# EAGLE design base-6u-at91sam7s-eval-r3 (EAGLE 5.09)
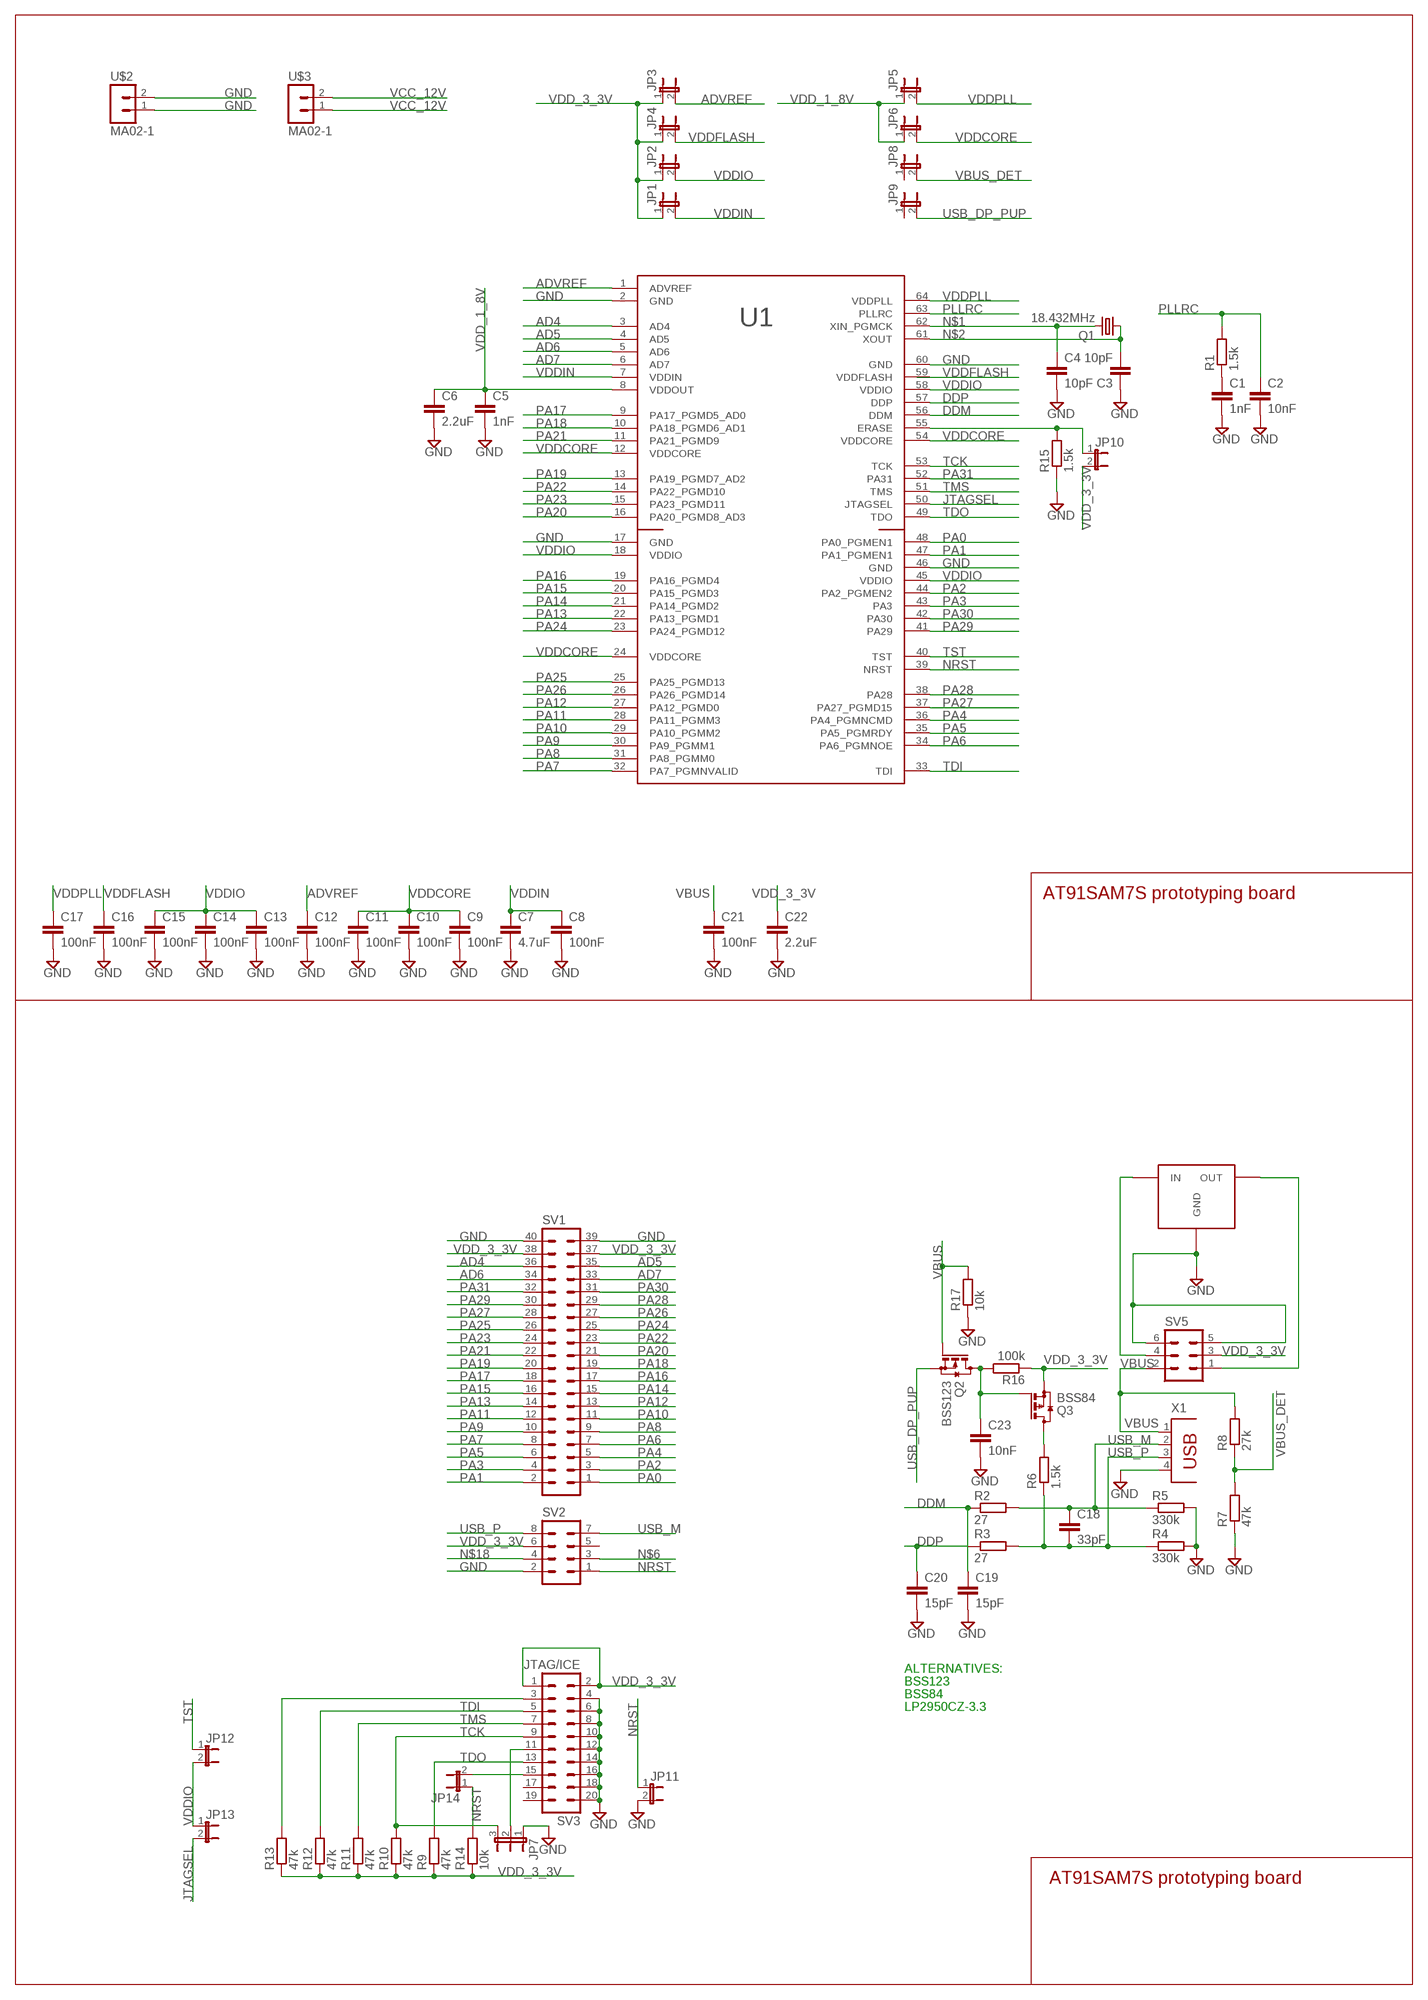
[diagram p0: schematic, sheet 1]

## Parts
C1  1nF  C-EUC0603  [C0603]
C2  10nF  C-EUC0603  [C0603]
C3  10pF  C-EUC0603  [C0603]
C4  10pF  C-EUC0603  [C0603]
C5  1nF  C-EUC0603  [C0603]
C6  2.2uF  C-EUC1206  [C1206]
C7  4.7uF  C-EUC1206  [C1206]
C8  100nF  C-EUC0603  [C0603]
C9  100nF  C-EUC0603  [C0603]
C10  100nF  C-EUC0603  [C0603]
C11  100nF  C-EUC0603  [C0603]
C12  100nF  C-EUC0603  [C0603]
C13  100nF  C-EUC0603  [C0603]
C14  100nF  C-EUC0603  [C0603]
C15  100nF  C-EUC0603  [C0603]
C16  100nF  C-EUC0603  [C0603]
C17  100nF  C-EUC0603  [C0603]
C18  33pF  C-EUC0603  [C0603]
C19  15pF  C-EUC0603  [C0603]
C20  15pF  C-EUC0603  [C0603]
C21  100nF  C-EUC0603  [C0603]
C22  2.2uF  C-EUC1206  [C1206]
C23  10nF  C-EUC0603  [C0603]
JP1  JP1E  [JP1]
JP2  JP1E  [JP1]
JP3  JP1E  [JP1]
JP4  JP1E  [JP1]
JP5  JP1E  [JP1]
JP6  JP1E  [JP1]
JP7  JP2E  [JP2]
JP8  JP1E  [JP1]
JP9  JP1E  [JP1]
JP10  JP1E  [JP1]
JP11  JP1E  [JP1]
JP12  JP1E  [JP1]
JP13  JP1E  [JP1]
JP14  JP1E  [JP1]
Q1  18.432MHz  CRYSTALHC49S  [HC49/S]
Q2  BSS123  [SOT23]
Q3  BSS84  [SOT23]
R1  1.5k  R-0603  [R0603]
R2  27  R-EU_R0603  [R0603]
R3  27  R-EU_R0603  [R0603]
R4  330k  R-EU_R0603  [R0603]
R5  330k  R-EU_R0603  [R0603]
R6  1.5k  R-EU_R0603  [R0603]
R7  47k  R-EU_R0603  [R0603]
R8  27k  R-EU_R0603  [R0603]
R9  47k  R-0603  [R0603]
R10  47k  R-0603  [R0603]
R11  47k  R-0603  [R0603]
R12  47k  R-0603  [R0603]
R13  47k  R-0603  [R0603]
R14  10k  R-0603  [R0603]
R15  1.5k  R-0603  [R0603]
R16  100k  R-EU_R0603  [R0603]
R17  10k  R-EU_R0603  [R0603]
SV1  MA20-2  [MA20-2]
SV2  MA04-2  [MA04-2]
SV3  JTAG/ICE  MA10-2W  [MA10-2W]
SV5  MA03-2  [MA03-2]
U1  AT91SAM7S64_LQFP64  [LQFP64]
U$1  LF33CDT  [TO-252]
U$2  MA02-1  [MA02-1]
U$3  MA02-1  [MA02-1]
X1  PN61729  [PN61729]

## Nets
AD4: SV1.36 U1.3(AD4)
AD5: SV1.35 U1.4(AD5)
AD6: SV1.34 U1.5(AD6)
AD7: SV1.33 U1.6(AD7)
ADVREF: C12.1 JP3.2 U1.1(ADVREF)
DDM: C19.1 R2.1 U1.56(DDM)
DDP: C20.1 R3.1 U1.57(DDP)
GND: C1.2 C2.2 C3.1 C4.2 C5.2 C6.2 C7.2 C8.2 C9.2 C10.2 C11.2 C12.2 C13.2 C14.2 C15.2 C16.2 C17.2 C19.2 C20.2 C21.2 C22.2 C23.2 JP7.1 JP11.2 R4.2 R5.2 R7.1 R15.1 R17.1 SV1.39 SV1.40 SV2.2 SV3.4 SV3.6 SV3.8 SV3.10 SV3.12 SV3.14 SV3.16 SV3.18 SV3.20 SV5.5 SV5.6 U1.2(GND) U1.17(GND) U1.46(GND) U1.60(GND) U$1.3(GND) U$2.1 U$2.2 X1.4
JTAGSEL: JP13.2 U1.50(JTAGSEL)
N$1: C4.1 Q1.2 U1.62(XIN_PGMCK)
N$2: C3.2 Q1.1 U1.61(XOUT)
N$3: C1.1 R1.1
N$6: SV2.3
N$7: Q3.3(D) R6.2
N$9: JP14.2 SV3.15
N$11: SV5.4 U$1.1(IN)
N$12: SV5.1 U$1.2(OUT)
N$13: R13.2 SV3.3
N$15: JP10.1 R15.2 U1.55(ERASE)
N$16: JP7.2 SV3.11
N$17: C23.1 Q2.3(D) Q3.1(G) R16.2
N$18: SV2.4
NRST: JP11.1 JP14.1 R14.2 SV2.1 U1.39(NRST)
PA0: SV1.1 U1.48(PA0_PGMEN1)
PA1: SV1.2 U1.47(PA1_PGMEN1)
PA2: SV1.3 U1.44(PA2_PGMEN2)
PA3: SV1.4 U1.43(PA3)
PA4: SV1.5 U1.36(PA4_PGMNCMD)
PA5: SV1.6 U1.35(PA5_PGMRDY)
PA6: SV1.7 U1.34(PA6_PGMNOE)
PA7: SV1.8 U1.32(PA7_PGMNVALID)
PA8: SV1.9 U1.31(PA8_PGMM0)
PA9: SV1.10 U1.30(PA9_PGMM1)
PA10: SV1.11 U1.29(PA10_PGMM2)
PA11: SV1.12 U1.28(PA11_PGMM3)
PA12: SV1.13 U1.27(PA12_PGMD0)
PA13: SV1.14 U1.22(PA13_PGMD1)
PA14: SV1.15 U1.21(PA14_PGMD2)
PA15: SV1.16 U1.20(PA15_PGMD3)
PA16: SV1.17 U1.19(PA16_PGMD4)
PA17: SV1.18 U1.9(PA17_PGMD5_AD0)
PA18: SV1.19 U1.10(PA18_PGMD6_AD1)
PA19: SV1.20 U1.13(PA19_PGMD7_AD2)
PA20: SV1.21 U1.16(PA20_PGMD8_AD3)
PA21: SV1.22 U1.11(PA21_PGMD9)
PA22: SV1.23 U1.14(PA22_PGMD10)
PA23: SV1.24 U1.15(PA23_PGMD11)
PA24: SV1.25 U1.23(PA24_PGMD12)
PA25: SV1.26 U1.25(PA25_PGMD13)
PA26: SV1.27 U1.26(PA26_PGMD14)
PA27: SV1.28 U1.37(PA27_PGMD15)
PA28: SV1.29 U1.38(PA28)
PA29: SV1.30 U1.41(PA29)
PA30: SV1.31 U1.42(PA30)
PA31: SV1.32 U1.52(PA31)
PLLRC: C2.1 R1.2 U1.63(PLLRC)
TCK: JP7.3 R10.2 SV3.9 U1.53(TCK)
TDI: R12.2 SV3.5 U1.33(TDI)
TDO: R9.2 SV3.13 U1.49(TDO)
TMS: R11.2 SV3.7 U1.51(TMS)
TST: JP12.1 U1.40(TST)
USB_DP_PUP: JP9.2 Q2.2(S)
USB_M: C18.1 R2.2 R5.1 SV2.7 X1.2
USB_P: C18.2 R3.2 R4.1 R6.1 SV2.8 X1.3
VBUS: C21.1 Q2.1(G) R8.2 R17.2 SV5.2 X1.1
VBUS_DET: JP8.2 R7.2 R8.1
VCC_12V: U$3.1 U$3.2
VDD_1_8V: C5.1 C6.1 JP5.1 JP6.1 U1.8(VDDOUT)
VDD_3_3V: C22.1 JP1.1 JP2.1 JP3.1 JP4.1 JP10.2 Q3.2(S) R9.1 R10.1 R11.1 R12.1 R13.1 R14.1 R16.1 SV1.37 SV1.38 SV2.6 SV3.1 SV3.2 SV5.3
VDDCORE: C9.1 C10.1 C11.1 JP6.2 U1.12(VDDCORE) U1.24(VDDCORE) U1.54(VDDCORE)
VDDFLASH: C16.1 JP4.2 U1.59(VDDFLASH)
VDDIN: C7.1 C8.1 JP1.2 U1.7(VDDIN)
VDDIO: C13.1 C14.1 C15.1 JP2.2 JP12.2 JP13.1 U1.18(VDDIO) U1.45(VDDIO) U1.58(VDDIO)
VDDPLL: C17.1 JP5.2 U1.64(VDDPLL)
Unconnected: JP8.1 JP9.1 SV2.5 SV3.17 SV3.19

## Notes on the sheet
- AT91SAM7S prototyping board
- ALTERNATIVES:
- BSS123
- BSS84
- LP2950CZ-3.3
- AT91SAM7S prototyping board

## Library data of the parts
C1-C23 = rcl:C-EU: CAPACITOR, European symbol
JP1-JP6 JP8-JP14 = jumper:JP1E: JUMPER
JP7 = jumper:JP2E: JUMPER
Q1 = crystal:CRYSTAL: CRYSTAL
Q2 = transistor-small-signal:BSS123: N-CHANNEL MOS FET
Q3 = transistor-small-signal:BSS84: P-CHANNEL MOS FET
R1 R9-R15 = quantum-sensor:R: Resistor
R2-R8 R16 R17 = rcl:R-EU_: RESISTOR, European symbol
SV1 = con-lstb:MA20-2: PIN HEADER
SV2 = con-lstb:MA04-2: PIN HEADER
SV3 = con-lstb:MA10-2W: PIN HEADER
SV5 = con-lstb:MA03-2: PIN HEADER
U1 = Atmel_Prototype_Header:AT91SAM7S64: Atmel AT91 ARM Thumb-based Microcontroller. LQFP64 package.
U$1 = my-to252:LF33CDT
U$2 U$3 = cls:MA02-1
X1 = con-berg:PN61729: BERG USB connector

## Board
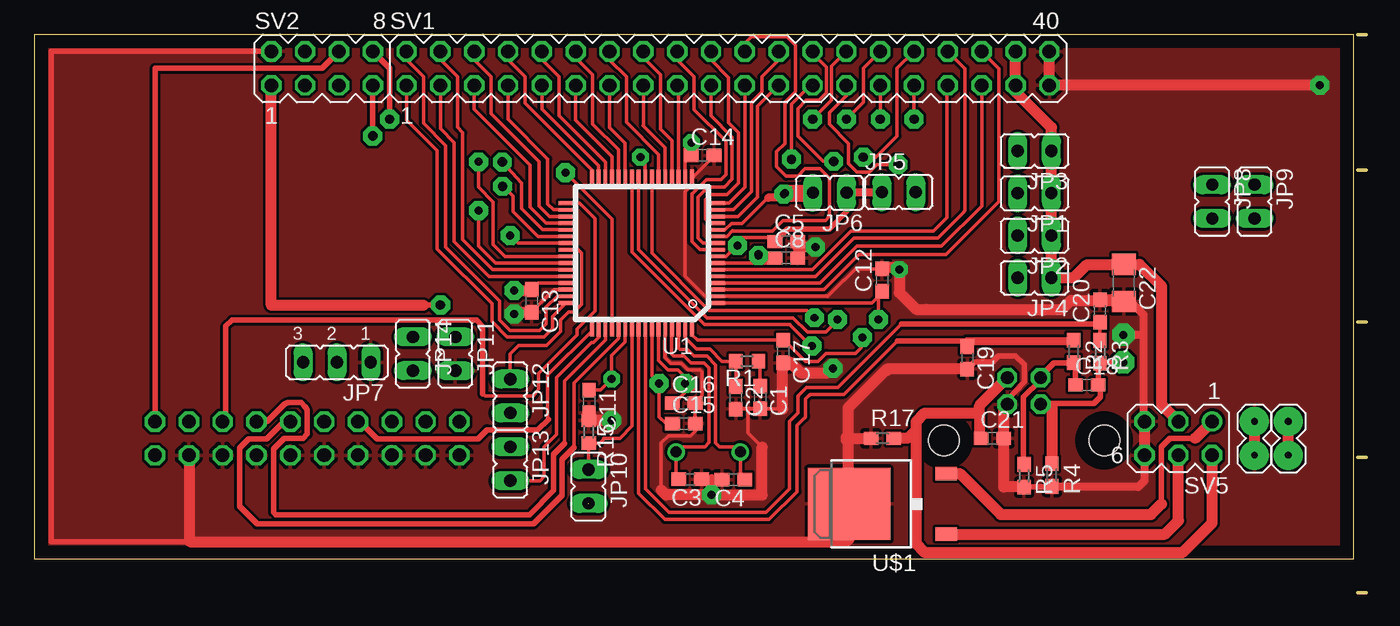
[diagram p1: board, top side]
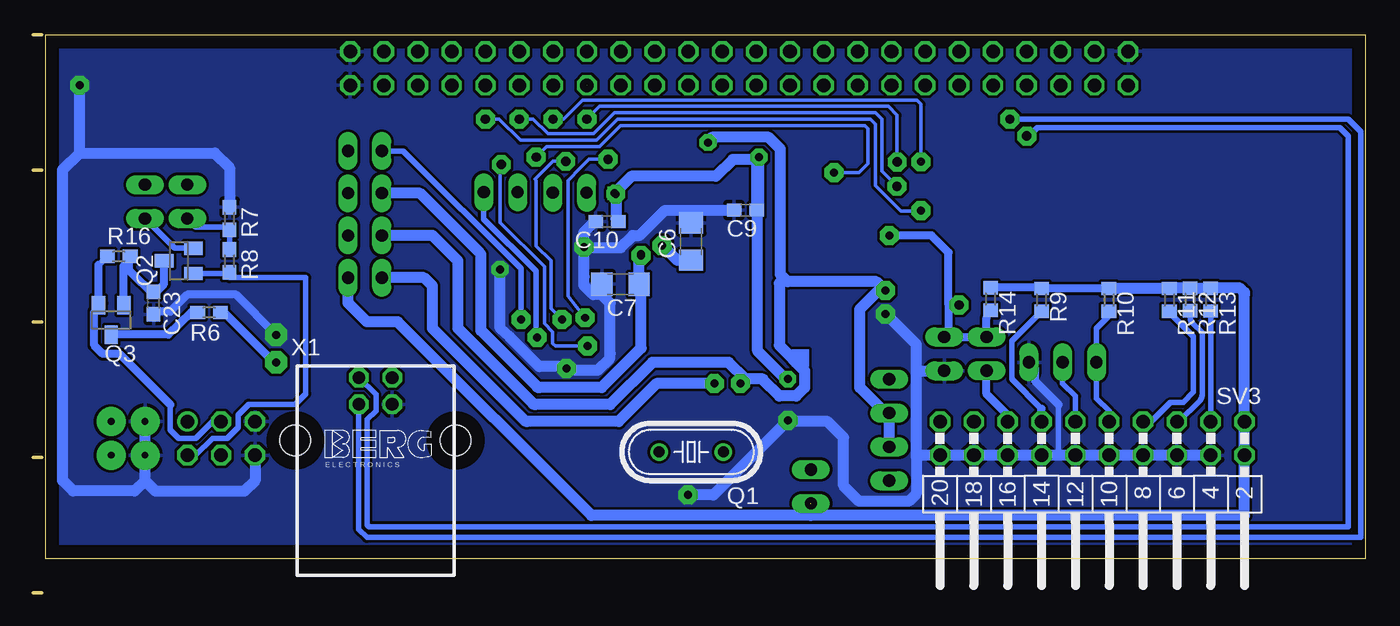
[diagram p2: board, bottom side, seen from below]

Size 99.99 x 41.92 mm. Coordinates in mm from the lower left corner, seen from the top.
Outline: 99.36,41.91 100,41.91
Outline: 99.36,31.75 100,31.75
Outline: 99.36,20.32 100,20.32
Outline: 99.36,10.16 100,10.16
Outline: 99.36,0 100,0
Outline: 0.01,2.54 99.07,2.54 99.07,41.92 0,41.92 0.01,2.54
Copper layers (1*16): Top 0.035mm / dielectric 1.5mm / Bottom 0.035mm
Design rules "default": minimum track width 10mil, minimum drill 24mil, track to track 8mil, track to pad 8mil, pad to pad 8mil, via to via 8mil, smd to smd 8mil, copper to edge 40mil, drill to drill 8mil, minimum pad ring 10mil, minimum via ring 8mil, stop-mask expansion 4mil, vias tented up to drill 0mil, thermal gap 10mil

### Footprints (pad centres in the part's own frame; a part is rotated, then mirrored left to right if it is on the bottom)
C0603 = smd 1.1 x 1: 1 -0.85,0; 2 0.85,0
C1206 = smd 1.6 x 1.8: 1 -1.4,0; 2 1.4,0
JP1 = drill 0.914 long: 1 0,-1.27; 2 0,1.27
JP2 = drill 0.914 long: 1 -2.54,0; 2 0,0; 3 2.54,0
HC49/S = drill 0.813 round: 1 -2.413,0; 2 2.413,0
SOT23 = smd 1 x 1.4: 1 -0.95,-1.1; 2 0.95,-1.1; 3 0,1.1
R0603 = smd 1 x 1.1: 1 -0.85,0; 2 0.85,0
R0603' = smd 1.1 x 1: 1 -0.85,0; 2 0.85,0
MA20-2 = drill 1.016 octagon: 1 -24.13,-1.27; 2 -24.13,1.27; 3 -21.59,-1.27; 4 -21.59,1.27; 5 -19.05,-1.27; 6 -19.05,1.27; 7 -16.51,-1.27; 8 -16.51,1.27; 9 -13.97,-1.27; 10 -13.97,1.27; 11 -11.43,-1.27; 12 -11.43,1.27; 13 -8.89,-1.27; 14 -8.89,1.27; 15 -6.35,-1.27; 16 -6.35,1.27; 17 -3.81,-1.27; 18 -3.81,1.27; 19 -1.27,-1.27; 20 -1.27,1.27; 21 1.27,-1.27; 22 1.27,1.27; 23 3.81,-1.27; 24 3.81,1.27; 25 6.35,-1.27; 26 6.35,1.27; 27 8.89,-1.27; 28 8.89,1.27; 29 11.43,-1.27; 30 11.43,1.27; 31 13.97,-1.27; 32 13.97,1.27; 33 16.51,-1.27; 34 16.51,1.27; 35 19.05,-1.27; 36 19.05,1.27; 37 21.59,-1.27; 38 21.59,1.27; 39 24.13,-1.27; 40 24.13,1.27
MA04-2 = drill 1.016 octagon: 1 -3.81,-1.27; 2 -3.81,1.27; 3 -1.27,-1.27; 4 -1.27,1.27; 5 1.27,-1.27; 6 1.27,1.27; 7 3.81,-1.27; 8 3.81,1.27
MA10-2W = drill 1.016 octagon: 1 -11.43,-1.27; 2 -11.43,1.27; 3 -8.89,-1.27; 4 -8.89,1.27; 5 -6.35,-1.27; 6 -6.35,1.27; 7 -3.81,-1.27; 8 -3.81,1.27; 9 -1.27,-1.27; 10 -1.27,1.27; 11 1.27,-1.27; 12 1.27,1.27; 13 3.81,-1.27; 14 3.81,1.27; 15 6.35,-1.27; 16 6.35,1.27; 17 8.89,-1.27; 18 8.89,1.27; 19 11.43,-1.27; 20 11.43,1.27
MA03-2 = drill 1.016 round: 1 -2.54,-1.27 | drill 1.016 octagon: 2 -2.54,1.27; 3 0,-1.27; 4 0,1.27; 5 2.54,-1.27; 6 2.54,1.27
LQFP64 = smd 1.1 x 0.285: 1 -5.7,3.75; 2 -5.7,3.25; 3 -5.7,2.75; 4 -5.7,2.25; 5 -5.7,1.75; 6 -5.7,1.25; 7 -5.7,0.75; 8 -5.7,0.25; 9 -5.7,-0.25; 10 -5.7,-0.75; 11 -5.7,-1.25; 12 -5.7,-1.75; 13 -5.7,-2.25; 14 -5.7,-2.75; 15 -5.7,-3.25; 16 -5.7,-3.75; 33 5.7,-3.75; 34 5.7,-3.25; 35 5.7,-2.75; 36 5.7,-2.25; 37 5.7,-1.75; 38 5.7,-1.25; 39 5.7,-0.75; 40 5.7,-0.25; 41 5.7,0.25; 42 5.7,0.75; 43 5.7,1.25; 44 5.7,1.75; 45 5.7,2.25; 46 5.7,2.75; 47 5.7,3.25; 48 5.7,3.75 | smd 0.285 x 1.1: 17 -3.75,-5.7; 18 -3.25,-5.7; 19 -2.75,-5.7; 20 -2.25,-5.7; 21 -1.75,-5.7; 22 -1.25,-5.7; 23 -0.75,-5.7; 24 -0.25,-5.7; 25 0.25,-5.7; 26 0.75,-5.7; 27 1.25,-5.7; 28 1.75,-5.7; 29 2.25,-5.7; 30 2.75,-5.7; 31 3.25,-5.7; 32 3.75,-5.7; 49 3.75,5.7; 50 3.25,5.7; 51 2.75,5.7; 52 2.25,5.7; 53 1.75,5.7; 54 1.25,5.7; 55 0.75,5.7; 56 0.25,5.7; 57 -0.25,5.7; 58 -0.75,5.7; 59 -1.25,5.7; 60 -1.75,5.7; 61 -2.25,5.7; 62 -2.75,5.7; 63 -3.25,5.7; 64 -3.75,5.7
TO-252 = smd 1 x 1.6: 1 -2.28,-6.07; 2 2.28,-6.07 | smd 5.4 x 6.2: 3 0,1.23
MA02-1 = drill 0.5 pad 2.184 round: 1 -1.27,0; 2 1.27,0
PN61729 = drill 0.95 octagon: 1 1.25,4.71; 2 -1.25,4.71; 3 -1.25,2.71; 4 1.25,2.71 | hole 2.3: -6.02,0; 6.02,0

### Placement (x,y rotation side)
C1  54.49,14.67 270 top
C2  52.66,14.63 270 top
C3  49.23,8.52 180 top
C4  52.47,8.49 180 top
C5  56.45,26.36 0 top
C6  50.6,26.38 90 bottom
C7  55.91,23.16 180 bottom
C8  56.45,25.14 0 top
C9  46.52,28.73 180 bottom
C10  56.92,27.87 180 bottom
C11  41.65,14.36 270 top
C12  63.65,23.47 90 top
C13  37.34,21.91 270 top
C14  50.18,32.83 0 top
C15  48.76,12.69 0 top
C16  48.75,14.22 0 top
C17  56.22,18.12 270 top
C18  79.02,15.59 0 top
C19  70.04,17.64 270 top
C20  80.01,21.16 90 top
C21  71.92,11.59 0 top
C22  81.81,23.26 270 top
C23  90.97,21.75 270 bottom
JP1  75.1,30 90 top
JP2  75.1,26.82 90 top
JP3  75.1,33.17 90 top
JP4  75.1,23.65 90 top
JP5  64.9,30.07 270 top
JP6  59.72,30.04 90 top
JP7  22.71,17.3 180 top
JP8  88.43,29.37 180 top
JP9  91.61,29.37 180 top
JP10  41.61,7.97 180 top
JP11  31.6,17.93 180 top
JP12  35.73,14.76 180 top
JP13  35.73,9.68 180 top
JP14  28.42,17.94 180 top
Q1  50.59,10.57 180 bottom
Q2  89.07,24.92 90 bottom
Q3  94.15,20.48 180 bottom
R1  53.52,17.38 180 top
R2  27  [R0603']  78.03,18.11 270 top
R3  27  [R0603']  80,18.09 270 top
R4  330k  [R0603']  76.39,8.83 270 top
R5  330k  [R0603']  74.31,8.78 270 top
R6  1.5k  [R0603']  86.8,21.05 180 bottom
R7  47k  [R0603']  85.26,28.09 270 bottom
R8  27k  [R0603']  85.26,24.92 270 bottom
R9  24.29,21.99 270 bottom
R10  19.24,21.98 270 bottom
R11  14.69,21.99 270 bottom
R12  13.13,22.02 270 bottom
R13  11.59,22 270 bottom
R14  28.12,22.05 270 bottom
R15  41.62,12.09 270 top
R16  100k  [R0603']  93.57,25.25 0 bottom
R17  10k  [R0603']  63.67,11.59 0 top
SV1  52.07,39.38 0 top
SV2  21.6,39.38 0 top
SV3  20.48,11.58 180 bottom
SV5  85.89,11.59 180 top
U1  45.61,25.5 180 top
U$1  62.4,6.66 90 top
U$2  91.61,11.59 90 top
U$3  94.15,11.59 90 top
X1  74.3,11.44 0 bottom

### Tracks (layer width: path | path; a pad name or v marks a point on that pad's centre or on a via)
AD4
  Top 0.254: U1.3 59.28,22.75 61.92,25.4 68.43,25.4 72.4,29.36 72.4,39.37 SV1.36
AD5
  Top 0.254: U1.4 58.99,23.25 61.76,26.03 68.11,26.03 71.13,29.05 SV1.35
AD6
  Top 0.254: U1.5 58.64,23.75 61.52,26.64 67.84,26.64 69.78,28.58 arc-45 69.79,28.6 69.87,28.68 69.87,39.36 SV1.34
AD7
  Top 0.254: U1.6 58.41,24.25 61.29,27.14 67.49,27.14 68.51,28.16 | 68.51,28.16 68.51,28.15 | 68.51,28.16 68.51,38.04 SV1.33
ADVREF  (via drill 0.6 pad 1.42)
  Top 0.254: v63.38,20.51 63.38,22.25 63.67,22.54 | 63.67,22.54 63.65,22.55 C12.1 | U1.1 62.88,21.75 63.67,22.54
  Bottom 0.406: v63.38,20.51 63.38,24.33 72.23,33.17 JP3.2
DDM
  Top 0.254: U1.56 45.36,7.46 47.34,5.48 55.17,5.48 57.26,7.58 57.26,12.54 57.83,13.11 arc45 57.9,13.29 57.9,14.54 58.17,14.81 arc-45 58.35,14.88 60.79,14.88 64.8,18.89 | 70.02,18.89 70.02,18.51 C19.1 | 77.97,18.89 R2.1
  Top 0.406: 64.8,18.89 70.02,18.89
  Top 0.61: 70.02,18.89 77.97,18.89
DDP
  Top 0.254: 45.88,19.77 45.88,7.78 47.63,6.03 54.94,6.03 56.68,7.77 56.68,12.75 arc-45 56.76,12.93 57.32,13.49 57.32,14.65 arc-45 57.39,14.83 57.95,15.39 60.33,15.39 65.1,20.16 | C20.1 80.05,20.3 79.96,20.21 | R3.1 80.02,18.93 80.01,18.95 C20.1 | 80.18,20.16 C20.1
  Top 0.305: U1.57 45.86,19.79 45.88,19.77
  Top 0.406: 65.1,20.16 80.18,20.16
GND  (via drill 0.6 pad 1.27, 0.6 pad 1.42, 0.6 pad 1.68)
  Top 0.254: 52.88,13.78 52.85,13.81 | 53.54,13.78 53.56,13.76 53.56,12 54.64,10.93 | C2.2 52.66,13.77 52.66,13.76 52.71,13.81 C1.2 | C1.2 54.51,13.81 54.52,13.8 54.5,13.78 53.54,13.78 | 53.54,13.78 52.88,13.78 | 53.54,13.78 53.5,13.78 53.48,13.8 53.46,13.78 52.88,13.78 | C17.2 56.18,17.23 56.18,13.79 56.17,13.8 54.48,13.8 | 54.48,13.8 54.47,13.8 | C1.2 54.48,13.8 | 51.29,22.25 51.26,22.25 51.24,22.23 51.21,22.26 50.35,22.26 48.85,23.76 48.85,30.12 49.36,30.63 U1.17 49.43,31.2 51.05,32.82 51.05,32.83 C14.2 | C13.2 39.03,22.75 U1.46 | 57.3,26.68 C5.2 57.3,25.94 C8.2 | 50.84,7.69 51.62,8.47 C4.2 50.86,8.48 50.1,8.48 50.09,8.47 50.08,8.48 C3.1 | 47.06,7.7 47.06,11.23 47.6,11.77 49.25,11.77 49.7,12.22 49.61,12.31 C15.2 49.61,12.72 49.59,12.73 49.6,12.74 C16.2 49.6,14.26 49.59,14.26 50.13,14.8 50.13,16.57 49.98,16.72 49.07,16.72 48.57,17.22 47.81,17.22 47.36,17.67 U1.60 | 82.08,21.94 82.08,21.74 82.04,21.79 arc45 81.86,21.86 C22.2 | C11.2 41.62,13.48 R15.1 | 51.29,22.25 U1.2 | 59.55,22.26 51.3,22.26 51.29,22.25 | 59.55,22.26 59.58,22.26 | 59.55,22.26 59.55,22.24 60.8,23.49 60.81,23.49 61.64,24.32 C12.2 63.65,24.43 | 63.65,24.43 63.67,24.44 | 63.57,24.42 63.64,24.42 63.65,24.43 | v64.94,24.28 64.94,24.42
  Top 0.406: SV3.18 | SV3.16 | SV3.14 | SV3.10 | SV3.12 | SV3.6 | SV3.8 | SV3.20 | 70.05,16.84 70.05,16.8 C19.2 70.56,17.31 71.92,17.31 72.4,17.79 73.67,17.79 74.32,17.13 74.32,15.8 73.03,14.45 | R5.2 76.28,7.92 76.39,7.92 R4.2 | 72.77,13.94 73.02,14.19 | SV3.4 | SV2.2 1.28,40.65 1.28,3.82 11.67,3.82
  Top 0.61: C17.2 56.25,17.3 | R4.2 76.25,7.97 76.24,7.96 76.28,7.92 82.87,7.92 83.35,8.41 SV5.6 | C22.2 81.83,21.86 | 82.08,21.74 82.41,21.74 83.28,20.88 83.28,19.53 | 83.28,19.53 83.28,12.93 SV5.5 | v81.77,19.36 83.11,19.36 83.28,19.53
  Top 0.813: v58.65,25.94 57.3,25.94 | 82.08,21.94 C20.2 | 82.08,21.94 77.84,21.94 77.16,21.27 66.97,21.27 66.21,21.27 64.94,22.54 v64.94,24.28 | 64.94,24.42 63.57,24.42 | 56.18,13.79 56.18,16.8 56.68,17.3 56.75,17.3 57.54,16.5 59.53,16.5 v59.97,16.84 | v43.33,12.93 R15.1 | 50.86,8.48 50.86,8.47 50.83,8.44 v50.83,7.33 | C13.2 36.08,21.06 v36.01,20.92 | 58.51,6.43 arc45 58.59,6.61 61.17,6.61 U$1.3 | 70.02,16.66 70.02,16.73 arc-45 C19.2 | 63.8,16.59 61.09,13.88 61.09,11.58 R17.1 | 63.8,16.59 arc-45 63.98,16.66 | C19.2 | C19.2 | 63.8,16.59 64,16.79 C19.2 | R5.2 72.77,7.92 C21.2 72.77,13.94 | SV5.5 SV5.6 | 82.08,21.94 82.08,21.74 | U$2.2 U$2.1 | SV1.40 SV1.39 v96.53,38.11 | SV3.4 11.67,10.24 11.67,3.82 60.97,3.82 61.17,4.02 U$1.3 | v96.53,38.11 | 73.02,14.19 73.02,14.18 X1.4 73.03,14.17 73.03,14.45 | v50.83,7.33 54.64,7.33 54.64,10.93 | 47.06,7.7 47.44,7.33 v50.83,7.33 | U$1.3 61.12,6.66 61.12,11.68 60.97,11.68 60.97,11.44
  Bottom 0.254: 36.36,21.11 36.18,20.92 v36.01,20.92 | SV3.6 | SV3.8 | SV3.10 | SV3.12 | SV3.16 | SV3.18 | SV3.20
  Bottom 0.406: v43.34,12.93 43.38,12.89 | v43.33,12.93 v43.34,12.93 | v43.34,12.93 43.17,13.1 | 90.97,21.11 C23.2 90.97,20.91 90.78,21.11 | C7.2 57.31,23.02 57.32,23.01 57.32,22.38 | 23.03,10.31 23.03,14.12
  Bottom 0.61: v81.77,19.36 84.78,22.38 88.43,22.38 89.7,21.11 90.78,21.11 | 23.03,14.12 24.77,15.87 24.77,16.82 JP7.1
  Bottom 0.813: 56.68,17.96 56.68,17.93 | 56.68,17.96 56.68,21.74 57.32,22.38 57.95,22.38 58.65,23.08 58.65,23.71 58.64,23.72 58.64,25.94 v58.65,25.94 | 56.68,17.96 56.7,17.96 56.7,17.6 57.6,16.7 59.76,16.7 59.99,16.93 59.98,16.94 v59.97,16.84 59.97,16.97 59.96,16.98 62,16.98 64.22,19.2 64.94,19.84 v64.94,24.28 | 91.61,8.41 U$2.2 | 91.61,8.41 90.81,7.62 84.15,7.62 83.35,8.41 SV5.6 | SV3.12 SV3.10 SV3.8 SV3.6 SV3.4 | SV3.12 23.03,10.31 SV3.14 SV3.16 SV3.18 30.65,10.31 SV3.20 33.69,10.31 33.69,10.17 | v36.01,20.92 35.97,20.92 33.69,18.64 33.69,16.52 | 33.69,10.17 33.69,7.43 34.26,6.87 37.99,6.87 39.15,8.02 39.15,11.65 40.35,12.85 43.35,12.85 43.33,12.87 v43.33,12.93 48.94,7.33 v50.83,7.33 | 33.69,10.17 33.69,16.52 | 50.65,28.73 52.56,28.73 54.46,26.82 54.98,26.82 55.9,25.9 58.62,25.9 v58.66,25.94 | 50.65,28.73 C9.2 | v58.66,25.94 58.67,25.95 | v58.65,25.94 v58.66,25.94 | 50.65,28.73 50.65,28.41 50.6,28.36 C6.2 | C10.2 57.77,27.91 57.79,27.94 58.65,27.08 v58.65,25.94 | R7.1 85.26,31.92 86.37,33.03 96.53,33.03 | 96.53,33.03 97.8,31.76 97.8,8.42 97,7.63 92.39,7.63 91.61,8.41 | 96.53,33.03 v96.53,38.11 | JP11.2 33.69,16.66 33.69,16.52
  pour Bottom: 0.01,41.92 99.07,41.92 99.07,2.55 0.01,2.55
  pour Top: 0.01,41.92 99.07,41.92 99.07,2.55 0.01,2.55
JTAGSEL
  Top 0.254: JP13.2 37.95,8.41 38.27,8.73 38.27,10.95 39.2,11.88 39.2,16.16 41.83,18.8 41.99,18.8 42.4,19.2 42.4,19.68 42.36,19.71 U1.50
N$1
  Top 0.254: Q1.2 53.01,10.63 | Q1.2 | U1.62 48.36,18.37 48.46,18.27 49.02,18.27 49.51,17.78 50.48,17.78 51.15,17.11 51.15,11.24 51.44,10.95 52.7,10.95 53.03,10.62 53.01,10.6 Q1.2 | Q1.2 53.01,10.61 | 53.43,8.48 53.51,8.41 | C4.1 53.43,8.48 | Q1.2 53.01,8.9 53.43,8.48
N$2
  Top 0.254: 47.85,19.81 47.85,19.84 | 47.85,19.81 U1.61 | 47.85,19.81 47.85,17.91 47.99,17.77 48.78,17.77 49.29,17.26 50.27,17.26 50.66,16.87 50.66,11.28 50.33,10.95 48.58,10.95 48.18,10.55 | 48.18,10.55 Q1.1 | 48.38,8.45 48.43,8.41 | 48.38,8.45 C3.2 | 48.18,10.55 48.18,8.65 48.38,8.45
N$3
  Top 0.254: 54.34,17.38 54.33,17.38 | 54.34,17.38 R1.1 | C1.1 54.49,17.23 54.34,17.38
N$7
  Bottom 0.406: 88.16,21.04 87.73,21.04 R6.2
  Bottom 0.61: Q3.3 89.85,19.37 88.16,21.04
N$9
  Bottom 0.254: JP14.2
  Bottom 0.61: SV3.15 26.83,13.33 28.43,14.92 JP14.2
N$11
  Top 0.813: U$1.1 84.88,4.38 85.89,5.39 SV5.4
N$12
  Top 0.406: 87.16,11.58 85.26,11.58 84.62,10.95 84.62,6.66
  Top 0.813: U$1.2 69.48,8.94 72.56,5.87 83.83,5.87 84.62,6.66 | 87.16,11.58 SV5.1
N$13
  Bottom 0.254: SV3.3 11.59,12.86
  Bottom 0.406: 11.59,12.86 R13.2
N$15
  Top 0.254: R15.2 41.59,11.23 41.57,11.21 41.84,10.95 | JP10.1 41.59,9.23 | JP10.1 | R15.2 41.62,9.26 JP10.1 | 41.61,11.15 41.62,11.16 R15.2 | 41.6,11.2 41.62,11.22 R15.2 | 41.6,11.2 42.42,11.2 42.72,11.5 42.72,11.57 42.71,11.58 43.96,11.58 44.86,12.52 U1.55 | 41.6,11.2 41.58,11.18
N$16
  Bottom 0.254: JP7.2 22.71,17.46
  Bottom 0.406: SV3.11 21.75,14.75 22.71,15.71 JP7.2
N$17
  Bottom 0.406: 93.2,24.6 92.72,25.07 R16.2 92.72,24.13 | 90.97,22.38 C23.1
  Bottom 0.61: Q3.1 93.2,24.6 | 92.72,24.13 90.97,22.38 90.17,23.18 Q2.3
NRST  (via drill 0.6 pad 1.42, 0.7 pad 1.42)
  Top 0.254: U1.39 36.3,26.25 v35.73,26.82
  Top 0.406: 29.22,21.6 v30.49,21.6
  Top 0.813: 29.22,21.6 17.79,21.6 SV2.1
  Bottom 0.254: 28.1,21.1 28.12,21.12 R14.2 28.12,20.96 28.11,20.95 28.42,20.64 | JP14.1 28.11,19.2 | 31.12,19.2 31.12,19.21
  Bottom 0.406: JP11.1 31.12,19.2 31.28,19.36 | v30.49,21.6 31.28,21.6
  Bottom 0.61: v35.73,26.82 32.55,26.82 31.28,25.55 31.28,21.6 31.28,19.36 | 28.42,20.64 JP14.1 31.12,19.21
PA0
  Top 0.254: U1.48 38.9,20.74 38.9,19.84 38.27,19.2 35.5,19.2 34.35,20.35 34.35,21.7 30.25,25.8 30.25,33.19 27.94,35.49 SV1.1
PA1
  Top 0.254: U1.47 39.24,22.25 38.42,21.44 38.42,20.17 37.95,19.69 35.72,19.69 34.93,20.49 34.93,21.91 30.88,25.96 30.88,33.58 29.22,35.25 29.22,38.74 27.95,40.01 SV1.2
PA2
  Top 0.254: SV1.3 30.48,34.84 31.52,33.81 31.52,26.36 34.12,23.75 U1.44
PA3
  Top 0.254: SV1.4 30.48,40.01 31.76,38.74 31.76,34.95 32.16,34.54 32.15,34.53 32.15,26.52 34.42,24.25 U1.43
PA4
  Top 0.254: U1.36 38.42,27.75 37.22,28.95 37.22,32.09 33.02,36.29 SV1.5
PA5
  Top 0.254: U1.35 38.69,28.25 37.9,29.04 37.9,32.35 34.3,35.96 34.3,38.74 33.03,40.01 SV1.6
PA6
  Top 0.254: U1.34 38.96,28.75 38.54,29.17 38.54,32.57 35.56,35.55 SV1.7
PA7
  Top 0.254: U1.32 41.86,31.74 36.84,36.77 36.84,38.74 35.56,40.01 SV1.8
PA8
  Top 0.254: U1.31 42.36,32.05 38.1,36.31 SV1.9
PA9
  Top 0.254: U1.30 42.86,32.32 39.38,35.81 39.38,38.74 38.1,40.01 SV1.10
PA10
  Top 0.254: U1.29 43.36,32.75 40.64,35.47 SV1.11
PA11
  Top 0.254: U1.28 43.86,33.25 41.91,35.2 41.91,35.23 41.92,35.24 41.92,38.89 40.64,40.17 SV1.12
  Top 0.305: 40.64,40.17 SV1.12
PA12
  Top 0.254: U1.27 44.36,33.75 43.21,34.9 43.18,34.93 SV1.13
PA13
  Top 0.254: U1.22 46.86,32.91 44.44,35.33 44.44,38.75 43.19,40 SV1.14
PA14
  Top 0.254: U1.21 47.36,33.42 45.71,35.07 45.72,35.08 SV1.15
PA15
  Top 0.254: U1.20 47.86,33.95 47.08,34.73 47,34.82 47,34.92 47,38.89 45.72,40.17
  Top 0.305: 45.72,40.17 SV1.16
PA16
  Top 0.254: U1.19 48.36,38.11 SV1.17
PA17
  Top 0.254: 51.31,25.74 51.32,25.73 | 51.31,25.74 U1.9 | 51.31,25.74 51.29,25.76 49.97,25.76 49.37,26.36 49.37,29.96 49.39,29.96 50.46,31.03 51.54,31.03 51.92,31.41 51.92,33.9 49.54,36.28 49.54,38.74 48.27,40.01 SV1.18
PA18
  Top 0.254: U1.10 51.25,26.25 51.24,26.24 51.23,26.25 50.19,26.25 49.83,26.61 49.83,29.72 50.56,30.45 51.8,30.45 52.39,31.04 52.39,34.22 50.8,35.81 50.8,35.87 SV1.19
PA19
  Top 0.254: U1.13 50.7,27.75 50.39,28.06 50.39,29.52 50.76,29.89 52.01,29.89 52.87,30.75 52.87,34.54 52.12,35.28 52.12,35.29 52.12,38.69 50.81,40.01 SV1.20
PA20
  Top 0.254: U1.16 52.14,29.25 53.34,30.45 SV1.21
PA21
  Top 0.254: U1.11 51.98,26.75 52.41,27.18 52.44,27.15 55.41,27.15 56.2,27.95 59.38,27.95 59.7,28.26 59.7,31.12 58.98,31.84 57.87,31.84 57.31,31.28 56.44,31.28 55.73,32 55.73,33.11 56.36,33.74 56.36,36.84 57.16,37.63 57.16,41.12 56.52,41.76 53.82,41.76 53.35,41.28 SV1.22
PA22
  Top 0.254: U1.14 52.83,28.25 54.3,29.72 54.3,36.52 SV1.23
PA23
  Top 0.254: U1.15 52.47,28.75 53.82,30.1 53.82,36.84 54.62,37.63 54.62,38.74 55.89,40.01 SV1.24
PA24  (via drill 0.6 pad 1.42, 0.7 pad 1.42)  (1 unrouted)
  Top 0.254: U1.23 46.36,25.49 50.66,21.19 58,21.2 v58.57,20.64 | SV1.25 58.26,38.1 56.84,36.68 56.84,33.03 v56.84,32.55
  Bottom 0.254: v58.57,20.64 59.86,22.26 59.86,30.96 58.9,31.92 58.27,32.55 v56.84,32.55
PA25  (via drill 0.6 pad 1.42, 0.7 pad 1.42)
  Top 0.254: U1.25 45.36,25.76 50.49,20.63 56.97,20.63 58.04,19.58 59.44,19.58 60.33,20.47 60.31,20.5 v60.31,20.52 | SV1.26 58.43,40.49 59.46,39.46 59.46,37.55 58.9,37 57.95,37 57.31,36.36 57.31,34.3 59.22,32.39 v60.01,32.39
  Bottom 0.254: v60.31,20.52 61.12,21.33 61.12,24.93 62.24,26.04 62.24,30.96 62.31,31.04 60.97,32.39 v60.01,32.39 | SV1.26
  other vias: 58.43,40.65
PA26  (via drill 0.6 pad 1.42, 0.7 pad 1.42)
  Top 0.254: U1.26 44.86,25.58 50.32,20.12 56.74,20.13 56.74,20.09 58.31,18.53 v58.38,18.53 | SV1.27 60.96,37.31 59.7,36.04 59.7,35.17 61.12,33.74 61.12,32.23 61.76,31.6 62.71,31.6 63.27,32.15 v64.85,32.15
  Bottom 0.254: v58.38,18.53 60.79,18.53 60.99,18.72 60.99,19.57 61.62,20.2 61.62,24.48 64.93,27.79 64.93,32.07 v64.85,32.15
PA27  (via drill 0.7 pad 1.42)
  Top 0.254: U1.37 38.16,27.25 36.56,28.85 36.56,30.76 v35.13,32.34 | SV1.28 60.01,39.7 59.85,39.54 59.85,37 v58.43,35.57
  Bottom 0.254: v58.43,35.57 57.47,36.52 35.8,36.52 35.13,35.85 v35.13,32.34
PA28  (via drill 0.7 pad 1.42)
  Top 0.254: U1.38 37.8,26.75 35.93,28.62 35.93,29.76 v35.15,30.51 | v63.51,35.57 63.51,37.31 SV1.29
  Bottom 0.254: v63.51,35.57 62.47,35.57 61.36,34.46 57.95,34.46 56.36,36.04 36.76,36.04 36.28,35.57 36.28,31.64 v35.15,30.51
PA29  (via drill 0.6 pad 1.42, 0.7 pad 1.42)  (1 unrouted)
  Top 0.254: U1.41 35.35,25.25 34.45,26.15 34.45,29.34 33.35,30.44 33.35,32.38 | SV1.30 62.24,39.38 62.24,36.84 v60.97,35.57
  Bottom 0.254: v60.97,35.57 60.17,35.57 58.74,37 33.66,37 33.34,36.68 v33.34,32.36 v33.35,32.35
PA30  (via drill 0.6 pad 1.42, 0.7 pad 1.42)
  Top 0.254: U1.42 34.64,24.75 33.35,26.04 v33.35,28.68 | SV1.31 v66.04,35.57 v66.05,35.57
  Bottom 0.254: v66.05,35.57 65.01,35.57 63.43,33.98 57.71,33.98 56.12,35.57 37.15,35.57 36.76,35.17 36.76,30.57 34.85,28.66 33.38,28.66 v33.35,28.68
PA31  (via drill 0.6 pad 1.42, 0.7 pad 1.42)
  Top 0.254: U1.52 43.36,28.05 v39.86,31.55 | SV1.32 64.78,39.38 64.78,34.3 63.19,32.71 v62.24,32.71
  Bottom 0.254: v39.86,31.55 37.99,31.55 37.31,32.23 37.31,34.85 37.55,35.09 55.89,35.09 57.47,33.5 61.44,33.5 v62.24,32.71
PLLRC
  Top 0.254: U1.63 48.85,19.8 48.83,19.78 48.83,19.16 49.71,18.28 50.73,18.28 51.64,17.38 R1.2 52.79,17.38 52.87,17.3 52.66,17.08 C2.1
TCK
  Top 0.254: U1.53 43.86,19.09 40.51,15.74 40.51,10.9 | 18.74,12.85 18.75,12.85 SV3.9
  Top 0.406: 40.51,10.9 39.6,9.99 39.6,7.29 37.46,5.15 16.72,5.15 15.4,6.47 15.4,10.86 16.07,11.53 17.42,11.53 18.74,12.85
  Bottom 0.254: SV3.9 | 19.24,20.77 R10.2
  Bottom 0.406: 19.21,12.82 SV3.9 | SV3.9 19.22,13.65 20.17,14.6 JP7.3 20.17,19.84 19.24,20.77
TDI  (via drill 0.6)
  Top 0.254: U1.33 40.92,29.25 42.08,28.09 42.08,21.16 40.73,19.81 40.73,19.33 38.15,16.75 38.16,16.75 | 38.16,16.75 38.17,16.76 | 38.16,16.75 37.86,16.46 37.86,15.31 37.47,14.76 33.82,14.76 33.66,14.92
  Top 0.406: 33.66,14.92 33.66,20 33.19,20.48 14.84,20.48 14.37,20.01 14.37,13.09 SV3.5
  Bottom 0.254: 13.13,20.68 R12.2 | 13.98,12.85 arc45 13.99,12.85 SV3.5
  Bottom 0.406: SV3.5 14.13,12.82 v14.19,12.82 | 13.13,20.68 arc-45 12.94,20.23 12.23,19.52 12.23,14.86 arc45 12.42,14.42 13.98,12.85
TDO
  Top 0.254: U1.49 41.86,19.66 38.53,16.33 38.53,13.05 38.54,13.05 38.59,13.01 | SV3.13 24.42,12.85
  Top 0.406: 24.42,12.85 25.73,11.53 33.3,11.53 33.98,12.22 37.79,12.22 38.59,13.01
  Bottom 0.254: 24.29,21.12 R9.2
  Bottom 0.406: 24.29,21.12 26.52,18.89 26.52,16.03 24.29,13.8
  Bottom 0.61: SV3.13 24.29,13.8
TMS
  Top 0.254: U1.51 42.86,18.96 39.79,15.89 39.79,11.21 | SV3.7 | 17.95,13.33 arc-67 17.95,13.33 | 17.95,6.03 18.12,5.85 | 17.47,12.85
  Top 0.406: 39.79,11.21 38.97,10.39 38.97,7.66 37.16,5.85 18.12,5.85 | SV3.7 17.47,12.85 17.95,13.33 | 17.95,13.33 18.71,14.1 arc-45 19.16,14.28 20.01,14.28 20.3,13.99 arc-45 20.49,13.54 20.49,11.9 20.17,11.59 18.74,11.59 17.95,10.79 17.95,6.03
  Bottom 0.254: SV3.7 | 14.69,21.04 R11.2 | SV3.7
  Bottom 0.406: 14.69,21.04 12.88,19.23 12.88,15.06 13.66,14.28 14.61,14.28 16.04,12.85 SV3.7
TST
  Top 0.254: U1.40 40.82,25.75 41.06,25.51 41.06,21.62 40.52,21.08 40.1,21.08 39.5,20.48 39.5,19.62 38.45,18.57 36.36,18.57 35.73,17.93 JP12.1
USB_DP_PUP
  Bottom 0.406: Q2.2 89.38,25.87 JP9.2
USB_M  (via drill 0.7 pad 1.42)
  Top 0.305: R2.2 78.02,17.25 78.01,17.24 78.17,17.08
  Top 0.406: 75.53,15.94 74.27,14.68 74.27,9.64 74.29,9.62 R5.1 | R2.2 78.01,17.28 | R2.2 78,17.25 77.96,17.3 77.9,17.24 76.54,17.24 75.53,16.23 | C18.1 78.17,17.12 R2.2 | v25.41,34.3 SV2.7
  Top 0.813: 75.53,16.23 75.55,16.21 X1.2 75.55,15.96 75.53,15.94
  Bottom 0.406: X1.2 74.27,14.87 74.27,14.68 74.27,13.66 74.94,13 74.94,5.09 74.78,4.93 1.28,4.93 1.28,34.3 1.91,34.93 24.61,34.93 25.25,34.3 v25.41,34.3
USB_P  (via drill 0.6 pad 1.68, 0.7 pad 1.42)
  Top 0.406: R4.1 76.41,9.7 | 79.89,15.54 79.87,15.56 C18.2 | C18.2 79.89,15.59 80.03,15.45 80.03,14.69 79.53,14.19 76.21,14.19 | C18.2 79.87,17.09 80,17.22 R3.2 80.11,17.23 80.18,17.3 v81.77,17.3 | v26.68,35.57 26.68,36.84 26.68,39.38 SV2.8 | 76.21,14.19 75.6,14.19 X1.3 | 76.21,14.19 76.41,13.99
  Top 0.813: 76.41,13.99 76.41,9.7
  Bottom 0.406: 85.89,21.11 R6.1 85.8,21.04 85.73,21.11 | v81.77,17.3 81.92,17.3 | X1.3 75.55,4.75 74.94,4.13 0.32,4.13 0.32,34.61 1.28,35.57 v26.68,35.57
  Bottom 0.61: 81.92,17.3 85.73,21.11
VBUS
  Top 0.406: 70.95,11.63 71.02,11.63 C21.1
  Top 0.61: SV5.2 88.59,10.31
  Top 0.813: 70.95,13.49 70.95,11.63 | 66.21,12.22 66.21,3.65 66.84,3.01 86.21,3.01 88.43,5.23 SV5.2 | 66.21,12.22 66.21,12.85 66.84,13.49 70.95,13.49 | R17.2 65.57,11.58 66.21,12.22 | 70.95,13.49 70.95,14.05 X1.1
  Bottom 0.406: Q2.1 85.57,23.97 85.26,24.28 R8.2 85.26,23.65 79.54,23.65 79.54,14.93 80.33,14.14 83.83,14.14 84.62,13.34 84.62,12.39 85.42,11.58 86.54,11.58 87.79,10.33 88.42,10.33 SV5.2
VBUS_DET
  Bottom 0.406: JP8.2 87.8,27.46 85.26,27.46 R7.2 R8.1
VCC_12V
  Top 0.813: U$3.1 U$3.2
VDD_1_8V  (via drill 0.6 pad 1.42)
  Top 0.254: U1.8 51.94,25.25 52.24,25.55 52.24,26.19 | 52.24,26.19 52.24,26.38 52.54,26.68 55.59,26.68 55.6,26.69 | 55.6,26.69 55.61,26.7 | 55.6,26.69 C5.1 | 52.24,26.19 52.36,26.07 v52.79,26.07
  Top 0.406: 60.97,30.04 JP6.1 60.99,28.6 59.7,27.31 56.55,27.31 C5.1
  Top 0.61: JP5.1 61.02,30.07 JP6.1
  Bottom 0.813: 52.79,26.11 52.87,26.19 | 52.79,26.11 v52.79,26.07 | C6.1 51.66,24.97 52.79,26.11
VDD_3_3V  (1 unrouted)
  Top 0.406: SV2.6 21.6,39.38 16.52,39.38 9.06,39.38 SV3.1
  Top 0.61: C22.1 81.71,24.66
  Top 0.813: JP3.1 JP1.1 JP2.1 JP4.1 78.06,23.65 79.03,24.62 81.73,24.62 81.77,24.58 81.81,24.62 C22.1 | JP3.1 76.37,33.6 | SV1.38 SV1.37 73.66,37.63 76.36,34.93 JP3.1 | SV5.3 84.62,14.12 84.62,16.66 84.62,23.01 82.98,24.66 81.71,24.66 | SV3.1
  Bottom 0.406: 94.42,25.28 94.15,25.55 | 94.42,25.28 R16.1 | 95.1,24.6 94.42,25.28 | SV5.3 86.53,12.85 87.8,11.58 89.07,11.58 89.7,12.22 89.7,14.12 | 94.95,21.57 94.78,21.74 | 94.95,21.57 Q3.2 | 95.42,21.11 94.95,21.57
  Bottom 0.61: Q3.2 95.1,24.6 | 89.7,14.12 93.51,17.93 94.78,17.93 95.42,18.57 95.42,21.11 | 19.27,22.79 R10.1 24.24,22.83 24.26,22.81 R9.1 24.31,22.81 24.4,22.9 R14.1
  Bottom 0.813: 41.61,5.79 9.06,5.79 SV3.2 | SV3.2 | SV3.2 SV3.1 | SV3.1 | SV3.1 9.05,22.37 9.06,22.38 9.06,22.55 9.37,22.86 11.54,22.86 11.55,22.85 R13.1 13.12,22.85 13.13,22.85 | 13.13,22.85 13.13,22.84 | 13.13,22.85 R12.1 14.68,22.86 R11.1 19.18,22.84 19.2,22.81 19.22,22.83 R10.1 | 41.61,5.79 58.1,5.79 72.63,20.33 74.94,20.33 76.36,21.76 JP4.1 | 41.61,6.67 41.61,6.66 41.61,5.79
VDDCORE  (via drill 0.6, 0.6 pad 1.27, 0.6 pad 1.42)
  Top 0.254: U1.54 44.36,18.83 43.34,17.81 v43.34,16.03 | 41.67,15.14 41.65,15.17 C11.1 42.52,15.21 v43.34,16.03 | U1.24 45.86,32.34 v45.51,32.69 | v43.34,16.03 v43.35,16.03 | U1.12 51.86,27.25 52.32,27.71 53.14,27.71 55.09,29.66 | 56.29,29.95 | v56.26,29.95 56.29,29.95 | 56.29,29.95 56,29.66
  Top 0.61: 56,29.66 55.09,29.66
  Top 0.813: v56.26,29.95 56.26,30.23
  Top 1.27: v56.37,30 58.4,30 JP6.2
  Bottom 0.813: v45.51,32.69 45.51,28.87 45.66,28.72 | 45.66,28.72 45.67,28.71 | v43.35,16.03 43.51,16.03 45.61,18.13 45.61,28.67 45.66,28.72 | 45.67,28.71 45.67,28.68 | 45.67,28.71 C9.1 45.66,28.72 | 45.67,28.68 45.61,28.62 | 45.67,28.68 45.67,32.44 45.57,32.54 47.48,32.54 48.75,31.27 55.1,31.27 v56.37,30 56.31,29.95 v56.26,29.95 56.26,28.07 C10.1
VDDFLASH  (via drill 0.6 pad 1.42)
  Top 0.254: U1.59 46.86,17.43 47.57,16.72 48.31,16.72 48.84,16.19 49.33,16.19 49.58,15.94 | 49.58,15.94 49.58,15.35 49.36,15.13 48.97,15.13 47.9,14.06 | 47.9,14.06 47.84,14 | C16.1 47.9,14.06 | 49.58,15.94 49.11,15.94 v48.86,15.69
  Bottom 0.813: v48.86,15.69 53.21,15.69 56.05,12.85 62.93,12.85 arc45 63.11,12.93 70.02,19.84 70.02,22.91 arc-45 70.09,23.09 70.65,23.65 JP4.2
VDDIN  (via drill 0.6, 0.6 pad 1.42)
  Top 0.254: C8.1 55.23,24.75 54.26,24.75 | 54.26,24.75 U1.7 | v54.36,25.44 54.27,24.76 54.26,24.75
  Top 0.406: C8.1 54.66,25.13 v54.37,25.32
  Bottom 0.813: JP1.2 arc-45 JP1.2 70.96,29.99 66.47,25.5 arc45 66.39,25.32 66.39,19.67 62.19,15.47 arc-45 62.01,15.39 57.32,15.39 54.35,18.36 54.35,23 C7.1 | C7.1 | C7.1 54.51,25.29 54.36,25.43 v54.36,25.44
VDDIO  (via drill 0.6 pad 1.27, 0.6 pad 1.42)
  Top 0.254: 46.39,19.82 U1.58 46.36,16.25 46.9,15.71 v46.91,15.72 46.91,13.19 47.42,12.69 C15.1 | U1.45 37.83,23.25 C13.1 | C14.1 48.85,32.35 48.85,31.21 U1.18 48.86,33.35 v49.32,33.81
  Top 0.813: 37.34,22.78 | 37.34,22.78 C13.1 | v36.02,22.68 37.24,22.68 37.34,22.78
  Bottom 0.254: v46.91,15.72 46.94,15.99 46.98,16.03
  Bottom 0.813: v49.32,33.81 49.14,33.81 48.96,33.99 48.96,34.1 49.05,34.19 44.78,34.19 43.91,33.32 43.91,23.9 43.61,23.6 | 43.61,23.6 43.36,23.35 36.69,23.35 v36.02,22.68 | 43.61,23.6 43.98,23.23 43.98,18.57 42.08,16.66 42.08,15.39 42.71,14.76 43.98,14.76 45.21,15.98 | 45.21,15.98 45.23,16 | 45.21,15.98 45.17,16.01 45.19,16.03 46.52,16.03 | 46.52,16.03 46.98,16.03 47.01,16.03 | 46.52,16.03 47.79,17.3 53.51,17.3 56.68,14.12 62.29,14.12 arc45 62.47,14.2 68.11,19.84 68.11,24.81 arc-45 68.19,24.99 70.02,26.82 JP2.2 | v36.02,22.68 36.06,22.68 36.07,22.69 36.06,22.7 | v36.02,22.68 36.21,22.68 36.37,22.84 37.93,21.28 37.93,15.4 36.02,13.49 JP12.2 JP13.1
VDDPLL  (via drill 0.6 pad 1.42)
  Top 0.254: U1.64 49.37,19.79 49.37,19.36 49.77,18.96 C17.1 56.28,18.96 57.88,17.36 58.84,17.36 59.44,17.96 61.65,17.96 62.06,18.37 62.06,19.14 62.03,19.18 v62.17,19.18
  Bottom 0.406: JP5.2 66.17,28.07 62.24,24.14 62.24,19.24 v62.17,19.18
(copper drawn outside any net)
  shapes: Bottom area x1

### Text on the board
Document: PA13 | PA12 | PA14 | PA12 = MISO | PA13 = MOSI | PA14 = SPCK | SPI | MISO | SCK | RST | VTG | MOSI | GND
tDocu: gnd | mosi | vcc | res | sck | miso | VDDIO | GND | VDDCORE | GND | ADVREF | PLLRC | VDDCORE | VDDPLL